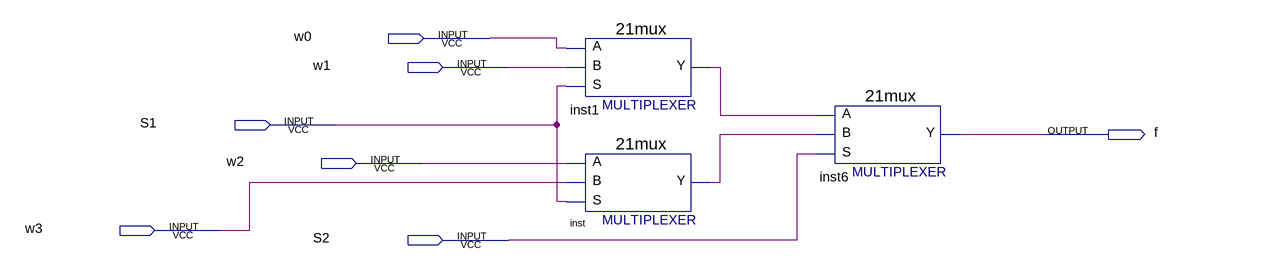
[diagram p0: schematic sheet]
// Quartus schematic lab4_mine.bdf as structural Verilog: 3 symbols, 7 pins
module lab4_mine (
  input  w0,
  input  w1,
  input  S1,
  input  w2,
  input  w3,
  input  S2,
  output f
);

  wire inst1_y, inst_y;

  \21mux  inst1 (.S(S1), .B(w1), .A(w0), .Y(inst1_y));
  \21mux  inst (.S(S1), .B(w3), .A(w2), .Y(inst_y));
  \21mux  inst6 (.S(S2), .B(inst_y), .A(inst1_y), .Y(f));
endmodule
